# EAGLE design untitled (EAGLE 9.6.2)
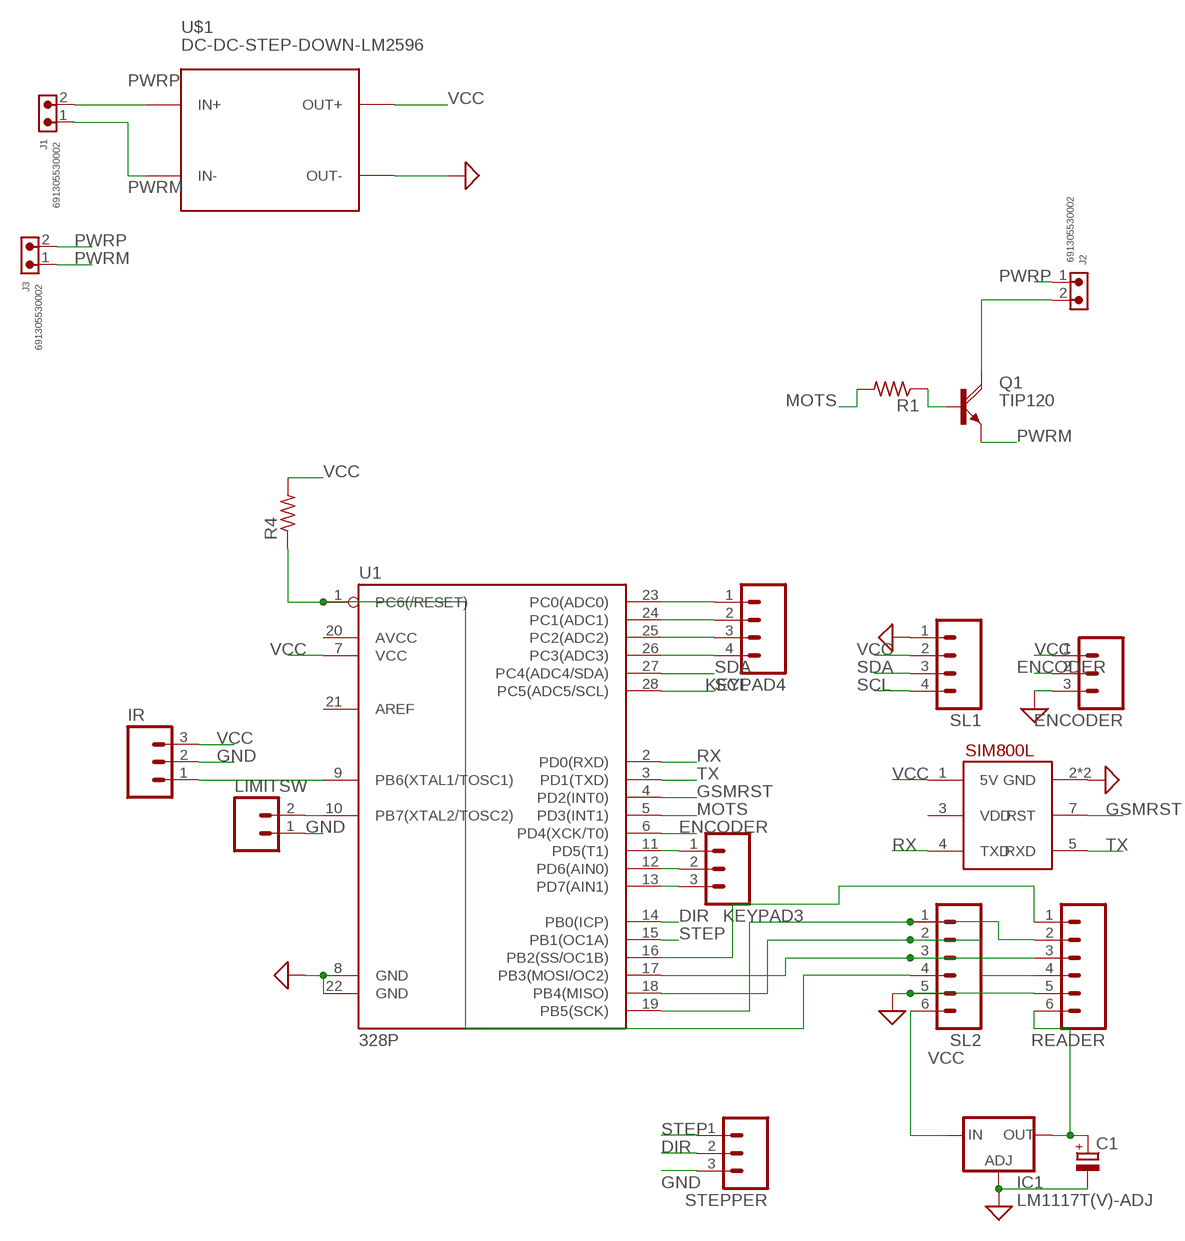
[diagram p0: schematic, sheet 1]

## Parts
C1  CPOL-EUE5-10.5  [E5-10,5]
ENCODER  M03  [03P]
IC1  LM1117T(V)-ADJ  [TO220V]
IR  M03  [03P]
J1  691305530002  691305530002  [691305530002]
J2  691305530002  691305530002  [691305530002]
J3  691305530002  691305530002  [691305530002]
KEYPAD3  M03  [03P]
KEYPAD4  M04  [04P]
LIMITSW  M02  [02P]
Q1  TIP120  [TO220AH]
R1  R-US_0207/15  [0207/15]
R4  R-US_0207/10  [0207/10]
READER  M06  [06P]
SL1  M04  [04P]
SL2  M06  [06P]
STEPPER  M03  [03P]
U1  328P  ATMEGA328P_PDIP  [DIP28]
U$1  DC-DC-STEP-DOWN-LM2596  [DC-DC-STEP-DOWN-LM2596]
U$2  SIM800L  [SIP]

## Nets
DIR: STEPPER.2 U1.14(PB0(ICP))
ENCODER: ENCODER.2 U1.6(PD4(XCK/T0))
GND: C1.- ENCODER.3 IC1.1(ADJ) IR.2 LIMITSW.1 READER.5 SL1.1 SL2.5 STEPPER.3 U1.8(GND) U1.22(GND) U$1.OUT- U$2.2(GND) U$2.6(GND) ; supply symbol labelled SUP
GSMRST: U1.4(PD2(INT0)) U$2.7(RST)
MOTS: R1.2 U1.5(PD3(INT1))
N$1: KEYPAD4.1 U1.23(PC0(ADC0))
N$2: LIMITSW.2 U1.10(PB7(XTAL2/TOSC2))
N$3: KEYPAD4.2 U1.24(PC1(ADC1))
N$4: READER.2 SL2.1 U1.19(PB5(SCK))
N$5: READER.4 SL2.2 U1.18(PB4(MISO))
N$6: READER.3 SL2.3 U1.17(PB3(MOSI/OC2))
N$7: R4.1 SL2.4 U1.1(PC6(/RESET))
N$8: KEYPAD4.3 U1.25(PC2(ADC2))
N$9: KEYPAD4.4 U1.26(PC3(ADC3))
N$10: KEYPAD3.1 U1.11(PD5(T1))
N$11: KEYPAD3.2 U1.12(PD6(AIN0))
N$12: KEYPAD3.3 U1.13(PD7(AIN1))
N$13: READER.1 U1.16(PB2(SS/OC1B))
N$14: C1.+ IC1.2(OUT) READER.6
N$15: Q1.B R1.1
N$16: J2.2 Q1.C
N$18: IR.1 U1.9(PB6(XTAL1/TOSC1))
PWRM: J1.1 J3.1 Q1.E U$1.IN-
PWRP: J1.2 J2.1 J3.2 U$1.IN+
RX: U1.2(PD0(RXD)) U$2.4(TXD)
SCL: SL1.4 U1.28(PC5(ADC5/SCL))
SDA: SL1.3 U1.27(PC4(ADC4/SDA))
STEP: STEPPER.1 U1.15(PB1(OC1A))
TX: U1.3(PD1(TXD)) U$2.5(RXD)
VCC: ENCODER.1 IC1.3(IN) IR.3 R4.2 SL1.2 SL2.6 U1.7(VCC) U$1.OUT+ U$2.1(5V)
Unconnected: U1.20(AVCC) U1.21(AREF) U$2.3(VDD)

## Library data of the parts
C1 = rcl:CPOL-EU: POLARIZED CAPACITOR, European symbol; SPICEPREFIX: C
ENCODER IR KEYPAD3 STEPPER = con-amp-quick:M03: AMP QUICK CONNECTOR; OC_FARNELL: unknown; OC_NEWARK: unknown
IC1 = lm1117_10:LM1117?-ADJ: 800mA Low-Dropout Linear Regulator Source: http://www.ti.com/lit/ds/symlink/lm1117-n.pdf; MF: Texas Instruments; MPN: LM1777T-ADJ; OC_FARNELL: 9485805; OC_NEWARK: 13B5345
J1-J3 = Wurth_Connectors_WR-TBL Pluggable Connector:691305530002: WR-TBL Serie 3055 - 5,08 mm - PCB Header Vertical Entry with Plastic Latches KIND PROPERTIES Pitch 5.08 mm MATERIAL PROPERTIES Insulator Material PA66 Insulator Flammability Rating UL94 V-0 Insulator Color Green Terminal Material Copper Alloy Terminal Plating Tin-plated surface GENERAL INFORMATION Operating Temperature -40 up to +105 °C ELECTRICAL PROPERTIES IR UL 16 A Working Voltage [UL] 300 V (AC) Withstanding Voltage [UL] 2500 V (AC) Contact Resistance [UL] 20 mΩ CERTIFICATION UL Approval E315414 <https://www.we-online.com/catalog/media/o135349v209%20Family_WR-TBL3_6913055300xx.jpg> Details see: https://www.we-online.com/catalog/en/TBL_5_08_3055_6913055300XX/ Updated by Ella Wu 2019-12-30 2019(C) Wurth Elektronik; DATASHEET-URL: https://www.we-online.com/catalog/datasheet/691305530002.pdf; IR-UL: 16A; MOUNT: THT; PART-NUMBER: 691305530002; PINS: 2; PITCH: 5.08mm; TYPE: Vertical; WORKING-VOLTAGE-UL: 300V (AC)
KEYPAD4 SL1 = con-amp-quick:M04: AMP QUICK CONNECTOR; OC_FARNELL: unknown; OC_NEWARK: unknown
LIMITSW = con-amp-quick:M02: AMP QUICK CONNECTOR; OC_FARNELL: unknown; OC_NEWARK: unknown
Q1 = transistor-power:TIP120: NPN DARLINGTON TRANSISTOR
R1 = adafruit:R-US_: RESISTOR, American symbol
R4 = BeagleBone_Black_Wireless:R-US_: RESISTOR, American symbol
READER SL2 = con-amp-quick:M06: AMP QUICK CONNECTOR; OC_FARNELL: unknown; OC_NEWARK: unknown
U1 = SparkFun-IC-Microcontroller:ATMEGA328P_PDIP: Atmel 328P Through hole ATMEGA328P uC used in the Arduino 32kb flash, 1k EEPROM, 2k SRAM Datasheet <http://www.sparkfun.com/datasheets/Components/SMD/ATMega328.pdf> SparkFun Products Storefront component: AVR 28 Pin 20MHz 32K 6A/D - ATMega328P <https://www.sparkfun.com/products/9061> (COM-09061) SparkFun Simon Says - Through-Hole Soldering Kit <https://www.sparkfun.com/products/10547> (KIT-10547) SparkFun Learn to Solder - Simon Says <https://www.sparkfun.com/products/13708> (KIT-13708) SparkFun BigTime Watch Kit <https://www.sparkfun.com/products/11734> (KIT-11734) SparkFun ClockIt <https://www.sparkfun.com/products/10930> (KIT-10930) SparkFun Serial Enabled LCD Kit <https://www.sparkfun.com/products/10097> (LCD-10097) SparkFun Simon Tilts - Through Hole Soldering Kit <https://www.sparkfun.com/products/12634> (KIT-12634) SparkFun Frequency Counter Kit <https://www.sparkfun.com/products/10140> (KIT-10140) FabFM Radio Kit <https://www.sparkfun.com/products/11043> (KIT-11043) SparkFun Binary Blaster Kit <https://www.sparkfun.com/products/12037> (KIT-12037) SparkFun Metro-Gnome <https://www.sparkfun.com/products/9236> (KIT-09236) ATmega328 with Arduino Optiboot (Uno) <https://www.sparkfun.com/products/10524> (DEV-10524); PROD_ID: IC-09136
U$1 = diy-modules:DC-DC-STEP-DOWN-LM2596: DC/DC Step-Down Regulator based on LM2596-ADJ chip LM2596 datasheet available here: http://www.ti.com/lit/ds/symlink/lm2596.pdf Click here to find device on ebay.com <http://www.ebay.com/sch/lm2596+power+regulator>
U$2 = sim800lv2.2:SIM800L: SIM800L Blue EVB Board with Level Translation and diode dropper.

## Board
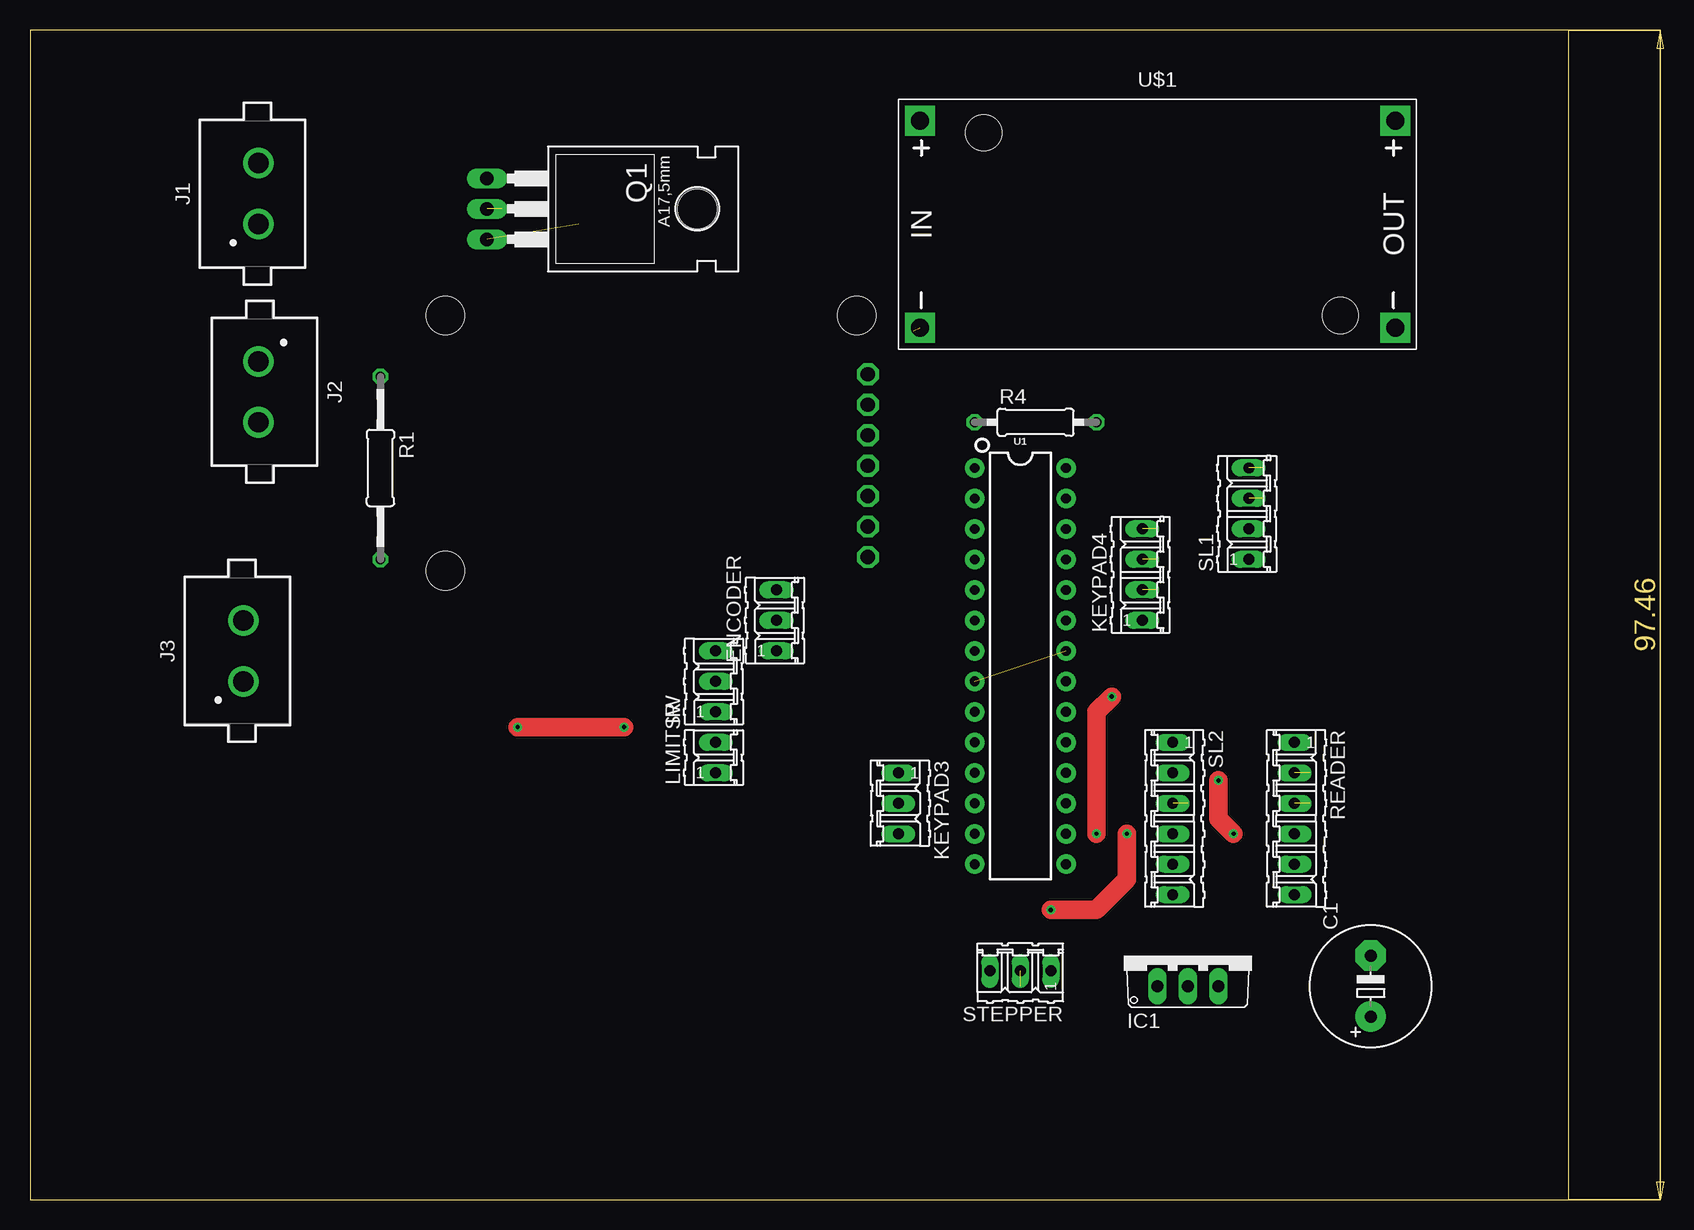
[diagram p1: board, top side]
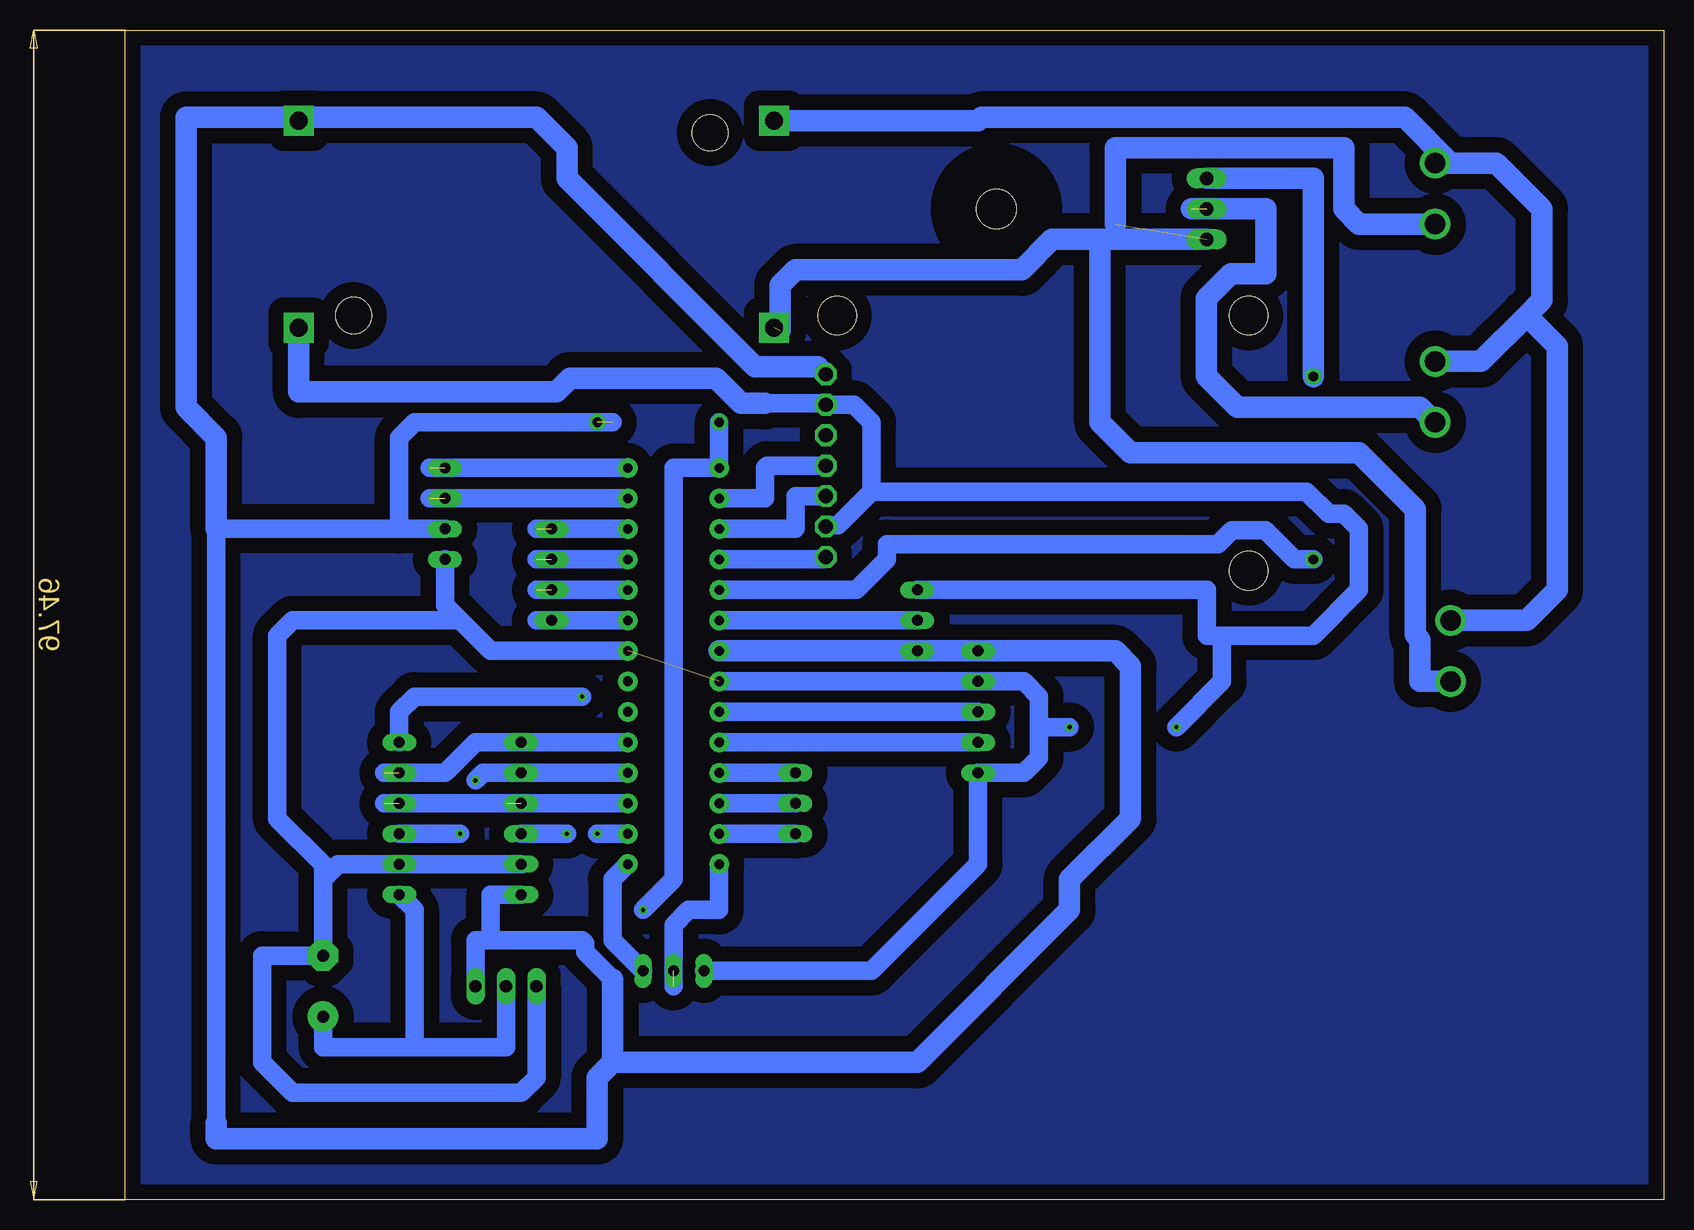
[diagram p2: board, bottom side, seen from below]

Size 128.25 x 97.46 mm. Coordinates in mm from the lower left corner, seen from the top.
Outline: 0,0 128.25,0 128.25,97.46 0,97.46 0,0
Copper layers (1*16): Top 0.035mm / dielectric 1.5mm / Bottom 0.035mm
Design rules "default *": minimum track width 6mil, minimum drill 0.35mm, track to track 30mil, track to pad 30mil, pad to pad 30mil, via to via 30mil, smd to smd 6mil, copper to edge 40mil, drill to drill 6mil, minimum pad ring 10mil, minimum via ring 8mil, stop-mask expansion 4mil, vias tented up to drill 0mil, thermal gap 10mil

### Footprints (pad centres in the part's own frame; a part is rotated, then mirrored left to right if it is on the bottom)
E5-10,5 = drill 1.016 pad 2.54: + -2.54,0 | drill 1.016 pad 2.54 octagon: - 2.54,0
03P = drill 0.914 long: 1 -2.54,0; 2 0,0; 3 2.54,0
TO220V = drill 1.016 long: 1 -2.54,-2.54; 2 0,-2.54; 3 2.54,-2.54
691305530002 = drill 1.7: 1 -2.54,0; 2 2.54,0
04P = drill 0.914 long: 1 -3.81,0; 2 -1.27,0; 3 1.27,0; 4 3.81,0
02P = drill 0.914 long: 1 -1.27,0; 2 1.27,0
TO220AH = drill 1.118 long: B -2.54,-6.35; C 0,-6.35; E 2.54,-6.35 | hole 3.302: 0,11.176
0207/15 = drill 0.813 octagon: 1 -7.62,0; 2 7.62,0
0207/10 = drill 0.813 octagon: 1 -5.08,0; 2 5.08,0
06P = drill 0.914 long: 1 -6.35,0; 2 -3.81,0; 3 -1.27,0; 4 1.27,0; 5 3.81,0; 6 6.35,0
DIP28 = drill 0.813 pad 1.626: 1 -16.51,-3.81; 2 -13.97,-3.81; 3 -11.43,-3.81; 4 -8.89,-3.81; 5 -6.35,-3.81; 6 -3.81,-3.81; 7 -1.27,-3.81; 8 1.27,-3.81; 9 3.81,-3.81; 10 6.35,-3.81; 11 8.89,-3.81; 12 11.43,-3.81; 13 13.97,-3.81; 14 16.51,-3.81; 15 16.51,3.81; 16 13.97,3.81; 17 11.43,3.81; 18 8.89,3.81; 19 6.35,3.81; 20 3.81,3.81; 21 1.27,3.81; 22 -1.27,3.81; 23 -3.81,3.81; 24 -6.35,3.81; 25 -8.89,3.81; 26 -11.43,3.81; 27 -13.97,3.81; 28 -16.51,3.81
DC-DC-STEP-DOWN-LM2596 = drill 1.5 pad 2.5 square: IN+ -19.812,8.636; IN- -19.812,-8.636; OUT+ 19.812,8.636; OUT- 19.812,-8.636 | hole 3: -14.478,7.62; 15.24,-7.62
SIP = drill 1.2 octagon: 1 38.1,19.24; 2 38.1,16.7; 3 38.1,14.16; 4 38.1,11.62; 5 38.1,9.08; 6 38.1,6.54; 7 38.1,4 | hole 3.2: 2.87,24.13; 2.87,2.87; 37.16,24.13

### Placement (x,y rotation side)
C1  111.76,17.78 90 top
ENCODER  62.23,48.26 90 top
IC1  96.52,20.32 0 top
IR  57.15,43.18 90 top
J1  19.05,83.82 90 top
J2  19.05,67.31 270 top
J3  17.78,45.72 90 top
KEYPAD3  72.39,33.02 270 top
KEYPAD4  92.71,52.07 90 top
LIMITSW  57.15,36.83 90 top
Q1  44.45,82.55 270 top
R1  29.21,60.96 270 top
R4  83.82,64.77 0 top
READER  105.41,31.75 270 top
SL1  101.6,57.15 90 top
SL2  95.25,31.75 270 top
STEPPER  82.55,19.05 180 top
U1  82.55,44.45 270 top
U$1  93.98,81.28 0 top
U$2  31.75,49.53 0 top

### Tracks (layer width: path | path; a pad name or v marks a point on that pad's centre or on a via)
DIR  (1 unrouted)
  Bottom 1.524: U1.14 78.74,24.13 81.28,24.13 82.55,22.86 82.55,17.78
ENCODER
  Bottom 1.524: ENCODER.2 U1.6
GND  (via drill 0.35)  (1 unrouted)
  Top 1.524: v49.53,39.37 v40.64,39.37
  Bottom 1.524: SL2.5 READER.5 110.49,27.94 111.76,26.67 | 111.76,26.67 C1.- 116.84,20.32 116.84,11.43 114.3,8.89 95.25,8.89 93.98,10.16 IC1.1 | U1.22 97.79,45.72 100.33,48.26 | 100.33,48.26 101.6,49.53 SL1.1 | U1.8 IR.2 53.34,43.18 52.07,41.91 52.07,39.37 | 52.07,39.37 52.07,36.83 53.34,35.56 LIMITSW.1 57.15,27.94 66.04,19.05 STEPPER.3 | 69.73,55.95 U$2.6 69.73,56.19 68.85,56.19 66.04,58.99 | 66.04,58.99 66.04,64.77 67.5,66.23 U$2.2 69.85,66.35 74.93,66.35 | 66.04,58.99 29.78,58.99 27.94,57.15 26.67,57.15 25.4,55.88 25.4,50.8 29.21,46.99 36.83,46.99 | 36.83,46.99 38.1,46.99 38.1,50.8 ENCODER.3 | 111.76,26.67 111.76,27.94 115.57,31.75 115.57,46.99 114.3,48.26 100.33,48.26 | 52.07,39.37 v49.53,39.37 | v40.64,39.37 36.83,43.18 36.83,46.99
  Bottom 1.778: 74.93,66.35 76.9,66.35 79.01,68.45 91.17,68.45 92.31,67.31 113.79,67.31 U$1.OUT-
GSMRST
  Bottom 1.524: U$2.7 70.04,53.34 U1.4
MOTS
  Bottom 1.524: U1.5 67.31,50.8 64.77,53.34 64.77,54.61 37.19,54.61 36.02,55.78 33.22,55.78 30.78,53.34 R1.2
N$1
  Bottom 1.524: U1.23 KEYPAD4.1 93.98,48.26
N$2
  Bottom 1.524: LIMITSW.2 U1.10
N$3  (1 unrouted)
  Bottom 1.524: U1.24 93.98,50.8
N$4  (1 unrouted)
  Bottom 1.524: U1.19 SL2.1 | SL2.1 96.52,38.1 | SL2.1 99.06,38.1 101.6,35.56 106.68,35.56
N$5  (via drill 0.35)
  Top 1.524: v100.33,30.48 99.06,31.75 v99.06,34.92
  Bottom 1.524: U1.18 SL2.2 98.42,35.56 v99.06,34.92 | READER.4 v100.33,30.48
N$6  (2 unrouted)
  Bottom 1.524: U1.17 96.52,33.02 | SL2.3 106.68,33.02
N$7  (via drill 0.35)
  Top 1.524: v91.44,30.48 91.44,26.67 88.9,24.13 v85.09,24.13
  Bottom 1.524: SL2.4 v91.44,30.48 | v85.09,24.13 82.55,26.67 82.55,60.96 U1.1 R4.1
N$8  (1 unrouted)
  Bottom 1.524: U1.25 93.98,53.34
N$9  (1 unrouted)
  Bottom 1.524: U1.26 93.98,55.88
N$10
  Bottom 1.524: KEYPAD3.1 U1.11
N$11
  Bottom 1.524: KEYPAD3.2 U1.12
N$12
  Bottom 1.524: KEYPAD3.3 U1.13
N$13  (via drill 0.35)
  Top 1.524: v90.17,41.91 88.9,40.64 v88.9,30.48
  Bottom 1.524: READER.1 105.41,40.64 104.14,41.91 v90.17,41.91 | v88.9,30.48 U1.16
N$14
  Bottom 1.524: IC1.2 96.52,12.7 104.14,12.7 | 104.14,12.7 111.76,12.7 C1.+ | READER.6 104.14,24.13 104.14,12.7
N$15
  Bottom 1.778: R1.1 29.21,85.09 Q1.B
N$16  (1 unrouted)
  Bottom 1.778: J2.2 20.32,66.04 35.56,66.04 38.12,68.61 38.12,75.11 36.07,77.17 33.17,77.17 33.17,82.55 39.37,82.55
N$17
  pour Bottom (isolate 1.27): 0,97.16 128.27,97.16 128.27,0 0,0
N$18
  Bottom 1.524: IR.1 U1.9
PWRM  (2 unrouted)
  Bottom 1.778: J3.1 20.32,43.18 20.32,46.66 20.71,47.05 20.71,57.54 25.4,62.23 44.45,62.23 46.99,64.77 46.99,80.01 | Q1.E 46.99,80.01 | 73.66,72.39 73.66,76.2 72.39,77.47 53.52,77.47 50.98,80.01 46.99,80.01 | J1.1 25.4,81.28 26.67,82.55 26.67,87.63 45.72,87.63 45.72,81.28
PWRP
  Bottom 1.778: J2.1 15.24,69.85 11.43,73.66 | 11.43,73.66 10.16,74.93 10.16,82.55 13.97,86.36 17.78,86.36 | J3.2 11.43,48.26 8.89,50.8 8.89,71.12 11.43,73.66 | 17.78,86.36 J1.2 | U$1.IN+ 57.15,89.92 56.9,90.17 21.59,90.17 17.78,86.36
RX
  Bottom 1.524: U$2.4 74.74,61.15 74.93,60.96 74.93,58.42 U1.2
SCL  (1 unrouted)
  Bottom 1.524: U1.28 102.87,60.96
SDA  (1 unrouted)
  Bottom 1.524: U1.27 102.87,58.42
STEP
  Bottom 1.524: STEPPER.1 87.63,21.59 87.63,26.67 U1.15
TX
  Bottom 1.524: U1.3 72.39,55.88 72.39,58.61 U$2.5
VCC  (1 unrouted)
  Bottom 1.524: IC1.3 99.06,21.59 97.79,21.59 | SL1.2 105.41,55.88 | 105.41,55.88 105.41,63.5 104.14,64.77 87.63,64.77 | 105.41,55.88 120.65,55.88 120.65,6.35 | 97.79,21.59 90.17,21.59 89.92,21.34 89.92,20.64 87.63,18.36 | 97.79,21.59 97.79,25.4 SL2.6
  Bottom 1.778: 87.63,18.36 87.63,11.43 | 87.63,11.43 62.23,11.43 49.53,24.13 49.53,26.67 44.45,31.75 44.45,44.45 45.72,45.72 IR.3 ENCODER.1 U1.7 | 87.63,11.43 88.9,10.16 88.9,5.08 120.65,5.08 120.65,6.35 | 120.65,55.88 120.65,63.5 123.19,66.04 123.19,90.17 114.05,90.17 | 114.05,90.17 U$1.OUT+ | U$2.1 70.48,69.41 75.75,69.41 91.44,85.09 91.44,87.63 93.98,90.17 114.05,90.17